# Altium schematic sheet arm_board.SchDoc
size A4
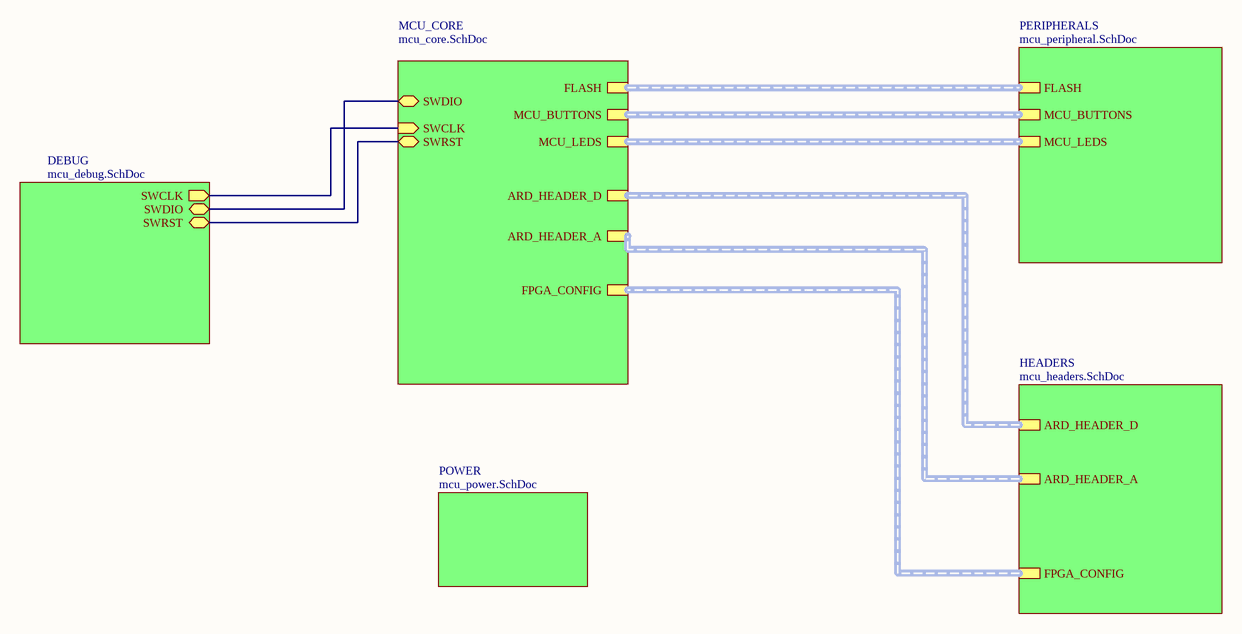
[diagram p0: arm_board.SchDoc]

## Sub-sheets
DEBUG = mcu_debug.SchDoc: SWCLK (out), SWDIO (bidir), SWRST (bidir)
HEADERS = mcu_headers.SchDoc: ARD_HEADER_D (harness ARD_HEADER_D), ARD_HEADER_A (harness ARD_HEADER_A), FPGA_CONFIG (harness FPGA_CONFIG)
MCU_CORE = mcu_core.SchDoc: SWDIO (bidir), SWRST (bidir), ARD_HEADER_A (harness ARD_HEADER_A), ARD_HEADER_D (harness ARD_HEADER_D), FPGA_CONFIG (harness FPGA_CONFIG), FLASH (harness FLASH), SWCLK (in), MCU_BUTTONS (harness MCU_BUTTONS), MCU_LEDS (harness MCU_LEDS)
PERIPHERALS = mcu_peripheral.SchDoc: FLASH (harness FLASH), MCU_BUTTONS (harness MCU_BUTTONS), MCU_LEDS (harness MCU_LEDS)
POWER = mcu_power.SchDoc: no entries

## Nets
(unnamed): sheet MCU_CORE/SWDIO, sheet DEBUG/SWDIO
(unnamed): sheet MCU_CORE/SWRST, sheet DEBUG/SWRST
(unnamed): sheet MCU_CORE/SWCLK, sheet DEBUG/SWCLK

## Buses and harness runs
harness sheet HEADERS/ARD_HEADER_A = sheet MCU_CORE/ARD_HEADER_A
harness sheet HEADERS/ARD_HEADER_D = sheet MCU_CORE/ARD_HEADER_D
harness sheet HEADERS/FPGA_CONFIG = sheet MCU_CORE/FPGA_CONFIG
harness sheet MCU_CORE/FLASH = sheet PERIPHERALS/FLASH
harness sheet MCU_CORE/MCU_BUTTONS = sheet PERIPHERALS/MCU_BUTTONS
harness sheet MCU_CORE/MCU_LEDS = sheet PERIPHERALS/MCU_LEDS